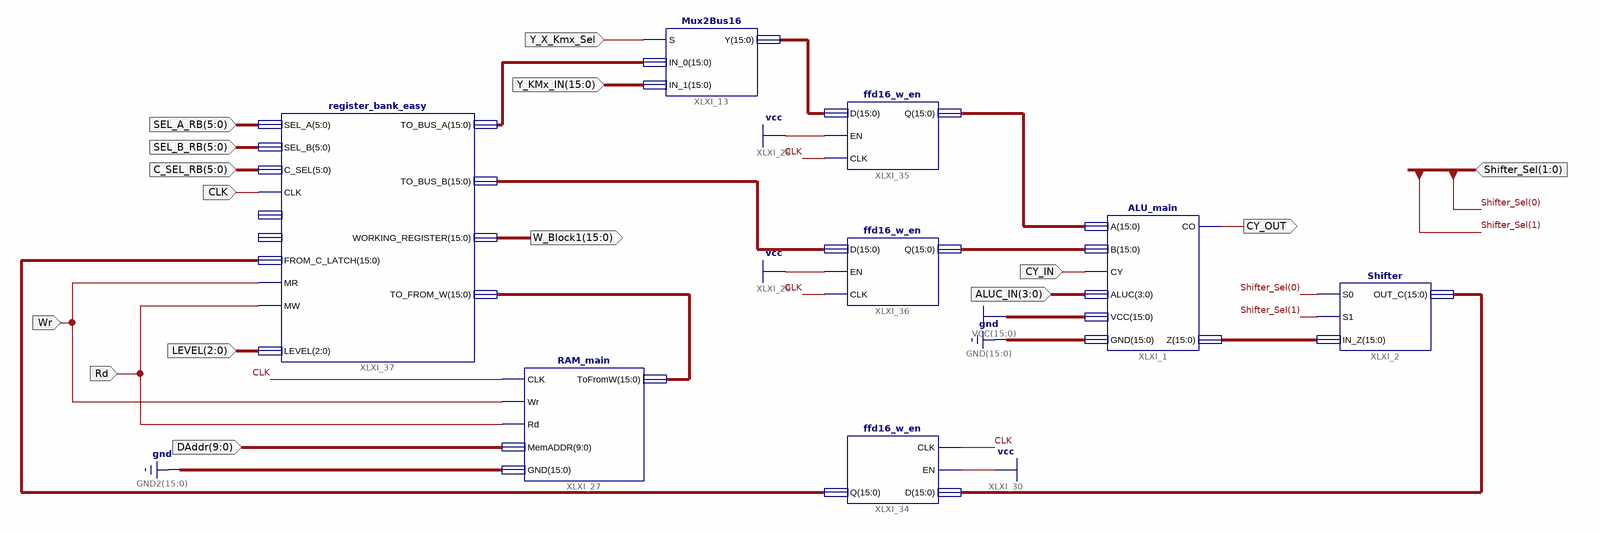
[diagram p0: schematic sheet 1]
// Xilinx ISE schematic ALU_Reg_Join.sch (artix7) as structural Verilog: 8 symbols, 15 ports
module ALU_Reg_Join (
  input  [15:0] Y_KMx_IN,
  input  Y_X_Kmx_Sel,
  input  [1:0] Shifter_Sel,
  input  CLK,
  input  [3:0] ALUC_IN,
  input  CY_IN,
  input  [5:0] SEL_A_RB,
  input  [5:0] SEL_B_RB,
  input  [5:0] C_SEL_RB,
  input  [9:0] DAddr,
  input  Rd,
  input  Wr,
  input  [2:0] LEVEL,
  output [15:0] W_Block1,
  output CY_OUT
);

  wire [15:0] XLXN_1, XLXN_3, XLXN_4, XLXN_5, XLXN_6, XLXN_7, XLXN_10, XLXN_11, XLXN_49;

  ALU_main XLXI_1 (
    .A(XLXN_3), .B(XLXN_4), .CY(CY_IN), .ALUC(ALUC_IN), .VCC({16{1'b1}}), .GND({16{1'b0}}), .CO(CY_OUT),
    .Z(XLXN_1));
  Shifter XLXI_2 (.S0(Shifter_Sel[0]), .S1(Shifter_Sel[1]), .IN_Z(XLXN_1), .OUT_C(XLXN_10));
  Mux2Bus16 XLXI_13 (.S(Y_X_Kmx_Sel), .IN_0(XLXN_7), .IN_1(Y_KMx_IN), .Y(XLXN_6));
  ffd16_w_en XLXI_34 (.D(XLXN_10), .EN(1'b1), .CLK(CLK), .Q(XLXN_11));
  ffd16_w_en XLXI_35 (.D(XLXN_6), .EN(1'b1), .CLK(CLK), .Q(XLXN_3));
  ffd16_w_en XLXI_36 (.D(XLXN_5), .EN(1'b1), .CLK(CLK), .Q(XLXN_4));
  register_bank_easy XLXI_37 (
    .SEL_A(SEL_A_RB), .SEL_B(SEL_B_RB), .C_SEL(C_SEL_RB), .CLK(CLK), .FROM_C_LATCH(XLXN_11), .MR(Wr),
    .MW(Rd), .LEVEL(LEVEL), .TO_FROM_W(XLXN_49), .TO_BUS_A(XLXN_7), .TO_BUS_B(XLXN_5),
    .WORKING_REGISTER(W_Block1));  // open: IN0, IN1
  RAM_main XLXI_27 (.CLK(CLK), .Wr(Wr), .Rd(Rd), .MemADDR(DAddr), .GND({16{1'b0}}), .ToFromW(XLXN_49));
endmodule
